# Altium schematic sheet Sheet1.SchDoc
size A; SheetNumber: 1; SheetTotal: 1
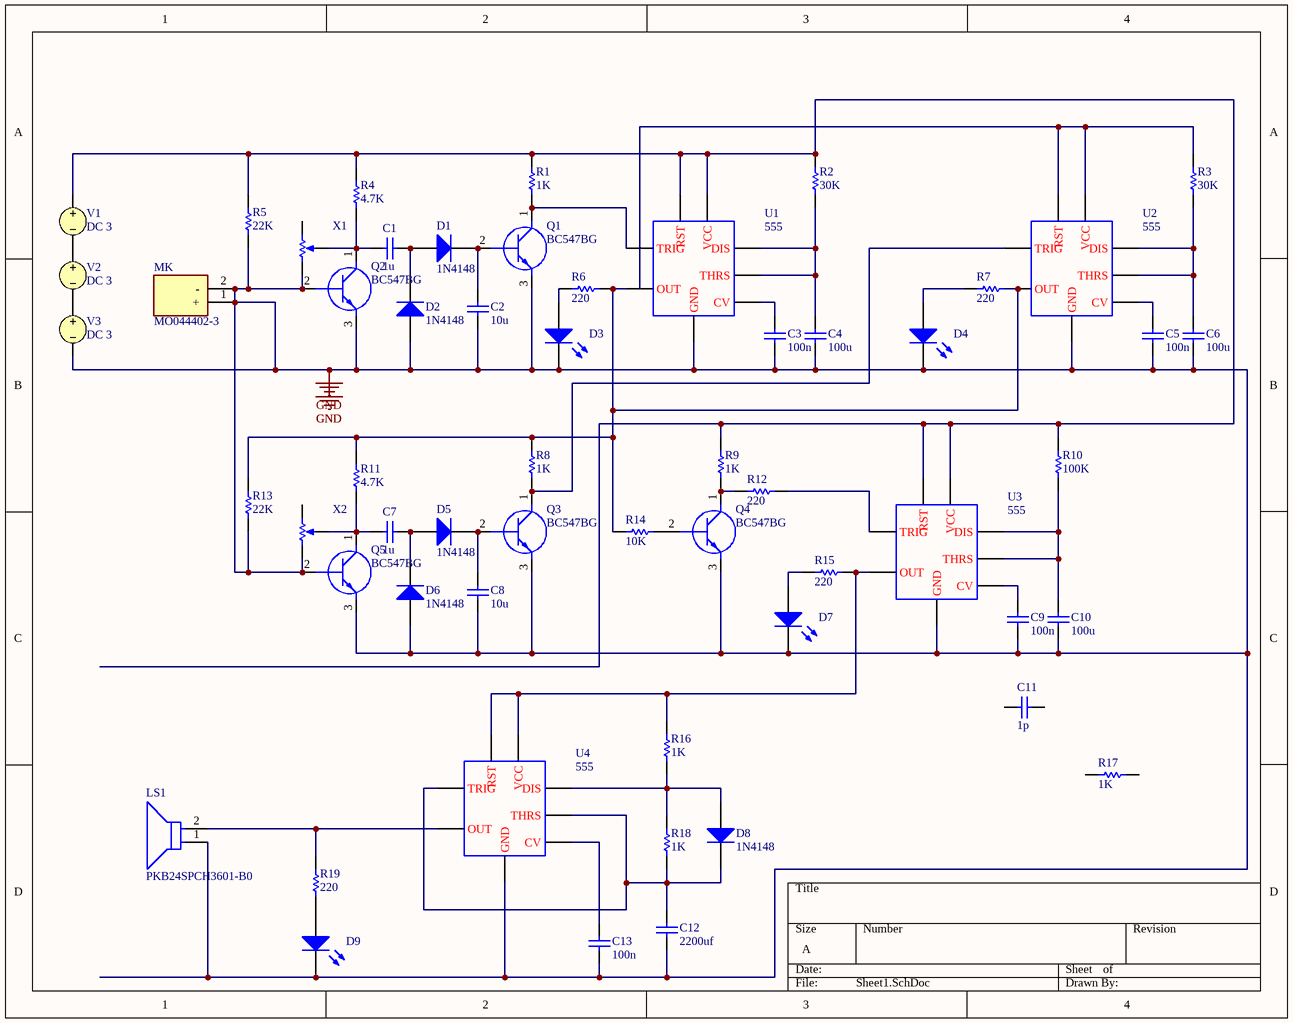
[diagram p0: Sheet1.SchDoc]

## Parts
C1  value 1u  (hidden comment: Capacitor)
C2  value 10u  (hidden comment: Capacitor)
C3  value 100n  (hidden comment: Capacitor)
C4  value 100u  (hidden comment: Capacitor)
C5  value 100n  (hidden comment: Capacitor)
C6  value 100u  (hidden comment: Capacitor)
C7  value 1u  (hidden comment: Capacitor)
C8  value 10u  (hidden comment: Capacitor)
C9  value 100n  (hidden comment: Capacitor)
C10  value 100u  (hidden comment: Capacitor)
C11  value 1p  (hidden comment: Capacitor)
C12  value 2200uf  (hidden comment: Capacitor)
C13  value 100n  (hidden comment: Capacitor)
D1  1N4148  [NXP-SOD27-2_V]
D2  1N4148  [NXP-SOD27-2_V]
D3  Light-Emitting Diode  (value not drawn)
D4  Light-Emitting Diode  (value not drawn)
D5  1N4148  [NXP-SOD27-2_V]
D6  1N4148  [NXP-SOD27-2_V]
D7  Light-Emitting Diode  (value not drawn)
D8  1N4148  [NXP-SOD27-2_V]
D9  Light-Emitting Diode  (value not drawn)
LS1  PKB24SPCH3601-B0  [FP-PKB24SPCH3601-B0-MFG]
MK  MO044402-3  [MO0444023]
Q1  BC547BG  [BC547BG]
Q2  BC547BG  [BC547BG]
Q3  BC547BG  [BC547BG]
Q4  BC547BG  [BC547BG]
Q5  BC547BG  [BC547BG]
R1  value 1K  (hidden comment: Resistor)
R2  value 30K  (hidden comment: Resistor)
R3  value 30K  (hidden comment: Resistor)
R4  value 4.7K  (hidden comment: Resistor)
R5  value 22K  (hidden comment: Resistor)
R6  value 220  (hidden comment: Resistor)
R7  value 220  (hidden comment: Resistor)
R8  value 1K  (hidden comment: Resistor)
R9  value 1K  (hidden comment: Resistor)
R10  value 100K  (hidden comment: Resistor)
R11  value 4.7K  (hidden comment: Resistor)
R12  value 220  (hidden comment: Resistor)
R13  value 22K  (hidden comment: Resistor)
R14  value 10K  (hidden comment: Resistor)
R15  value 220  (hidden comment: Resistor)
R16  value 1K  (hidden comment: Resistor)
R17  value 1K  (hidden comment: Resistor)
R18  value 1K  (hidden comment: Resistor)
R19  value 220  (hidden comment: Resistor)
U1  555
U2  555
U3  555
U4  555
V1  DC 3
V2  DC 3
V3  DC 3
X1  Potentiometer  (value not drawn)
X2  Potentiometer  (value not drawn)

## Nets
GND: C2.1 C3.1 C4.1 C5.1 C6.1 C8.1 C9.1 C10.1 C12.1 C13.1 D2.1(A) D3.2(K) D4.2(K) D6.1(A) D7.2(K) D9.2(K) LS1.1(C) MK.1(+) MK.2(-) Q1.3(E) Q2.2(B) Q2.3(E) Q3.3(E) Q4.3(E) Q5.2(B) Q5.3(E) R5.1 R13.1 U1.1(GND) U2.1(GND) U3.1(GND) U4.1(GND) V3.2 X1.1(TOP) X2.1(TOP)
NetC1_1: C1.1 Q2.1(C) R4.1 X1.3(TAP)
NetC1_2: C1.2 D1.1(A) D2.2(K)
NetC2_2: C2.2 D1.2(K) Q1.2(B)
NetC3_2: C3.2 U1.5(CV)
NetC4_2: C4.2 R2.1 U1.6(THRS) U1.7(DIS)
NetC5_2: C5.2 U2.5(CV)
NetC6_2: C6.2 R3.1 U2.6(THRS) U2.7(DIS)
NetC7_1: C7.1 Q5.1(C) R11.1 X2.3(TAP)
NetC7_2: C7.2 D5.1(A) D6.2(K)
NetC8_2: C8.2 D5.2(K) Q3.2(B)
NetC9_2: C9.2 U3.5(CV)
NetC10_2: C10.2 R10.1 U3.6(THRS) U3.7(DIS)
NetC12_2: C12.2 D8.2(K) R18.1 U4.2(TRIG) U4.6(THRS)
NetC13_2: C13.2 U4.5(CV)
NetD3_1: D3.1(A) R6.1
NetD4_1: D4.1(A) R7.1
NetD7_1: D7.1(A) R15.1
NetD8_1: D8.1(A) R16.1 R18.2 U4.7(DIS)
NetD9_1: D9.1(A) R19.1
NetLS1_2: LS1.2(A) R19.2 U4.3(OUT)
NetQ1_1: Q1.1(C) R1.1 U1.2(TRIG)
NetQ3_1: Q3.1(C) R8.1 U2.2(TRIG)
NetQ4_1: Q4.1(C) R9.1 R12.1
NetQ4_2: Q4.2(B) R14.2
NetR1_2: R1.2 R2.2 R4.2 R5.2 R9.2 R10.2 U1.4(RST) U1.8(VCC) U3.4(RST) U3.8(VCC) V1.1
NetR3_2: R3.2 U2.4(RST) U2.8(VCC)
NetR6_2: R6.2 R7.2 R8.2 R11.2 R13.2 R14.1 U1.3(OUT) U2.3(OUT)
NetR12_2: R12.2 U3.2(TRIG)
NetR15_2: R15.2 R16.2 U3.3(OUT) U4.4(RST) U4.8(VCC)
NetV1_2: V1.2 V2.1
NetV2_2: V2.2 V3.1

Not connected (* = marked no-connect by the designer): C11 1 2; R17 1 2; X1 2(BOT); X2 2(BOT)

## Library data of the parts
C1-C13 = Capacitor: SimulationGenericComponent: True
D1 D2 D5 D6 D8 = CMP-0648-00002-1: High-speed Diode, 100 V, 450 mA, 2-Pin SOD27, RoHS; Manufacturer: NXP Semiconductors; Configuration: Single; IR (VR: 20 V)=25 nA; IFRM: 450 mA; IFSM: 4 A Max.; Trr: 4 ns Max.; Cd: 4 pF Max.; VR: 100 V Max.; VF (IF: 10 mA)=1 V; IF: 200 mA Max.; ComponentLink1Description: Manufacturer URL; RoHS: TRUE; ComponentLink1URL: http://www.nxp.com/; ComponentLink3Description: Package Specification; DatasheetVersion: Aug-04; ComponentLink2Description: Datasheet; PackageVersion: Aug-04; PackageReference: SOD27; ComponentLink3URL: http://www.nxp.com/documents/data_sheet/1N4148_1N4448.pdf; Mounting Technology: Through Hole; ComponentLink2URL: http://www.nxp.com/documents/data_sheet/1N4148_1N4448.pdf; PartNumber: 1N4148; PackageDescription: 2-Pin Hermetically Sealed Glass Package, Axial Leaded, Dia 1.85 mm, Body Length 4.25 mm, Lead Spread 25.4 mm
D3 D4 D7 D9 = LED: AF: 1; BV: 0; BV_MAX: 1e99; EG: 1.11; FC: 0.5; IBV: 0.001; IS: 1e-14; MJSW: 0.33; NTUN: 30; TNOM: 27; XTI: 3; SimulationGenericComponent: True; CJO: 0; CJP: 0; CTA: 0; CTP: 0; FCS: 0.5; FV_MAX: 1e99; IKF: 0; IKR: 0; ISR: 1e-14; JSW: 0; JTUN: 0; JTUNSW: 0; KEG: 1; KF: 0; LEVEL: 1; N: 1; NBV: 1; NR: 1; NS: 1; PHP: 1; RS: 0; TCV: 0; TLEV: 0; TLEVC: 0; TM1: 0; TM2: 0; TPB: 0; TPHP: 0; TRS: 0; TRS2: 0; TT: 0; TTT1: 0; TTT2: 0; VJ: 1; XTITUN: 3
LS1 = CMP-06203-000001-2: AUDIO PIEZO TRANSDUCER 3-15V TH; Self Resonant Frequency: 3.6kHz; Voltage Rating (DC): 15V; Min Supply Voltage: 3V; Operating Supply Current: 16mA; Voltage Rating: 12V; Max Frequency: 4.1kHz; Washable: No; REACH SVHC: No SVHC; Packaging: Bulk; Frequency: 3.6kHz; Max Operating Temperature: 70°C; Max Supply Voltage: 15V; Max Supply Voltage (DC): 15V; Diameter: 24.3mm; Lead Free: Lead Free; Radiation Hardening: No; Nominal Supply Current: 16mA; Height: 9.7mm; Mount: Flush; Nominal Supply Voltage (DC): 12V; Min Operating Temperature: -20°C; Termination: PC Pins; Length: 24.3mm; Package Quantity: 650; Min Supply Voltage (DC): 3V; Max Supply Current: 16mA
MK = MO044402-3: Microphone; Manufacturer_Name: DB Unlimited; Datasheet Link: https://www.dbunlimitedco.com/images/product_images/2D-Drawings/MO044402-3.pdf; Height: 1.3mm; Manufacturer_Part_Number: MO044402-3; Mouser Part Number: 497-MO044402-3; Mouser Price/Stock: https://www.mouser.co.uk/ProductDetail/DB-Unlimited/MO044402-3?qs=t9M3m0YJX4P%252B6U8YhOQ9OQ%3D%3D; Arrow Part Number: MO044402-3; Arrow Price/Stock: https://www.arrow.com/en/products/mo044402-3/db-unlimited?region=nac
Q1-Q5 = BC547BG: Transistor BJT NPN; Manufacturer_Name: onsemi; Datasheet Link: https://www.onsemi.com/download/data-sheet/pdf/BC546-D.PDF; Height: 5.33mm; Manufacturer_Part_Number: BC547BG; Mouser Part Number: N/A; Mouser Price/Stock: http://www.mouser.com/Search/ProductDetail.aspx?qs=NSmgnqlvnz5NIKIycfR5CQ%3d%3d; Arrow Part Number: BC547BG; Arrow Price/Stock: http://www.arrow.com/en/products/bc547bg/on-semiconductor
R1-R19 = Resistor: TC1: 0; SimulationGenericComponent: True; TC2: 0
U1-U4 = 555: Timer 555; SimulationGenericComponent: True
V1-V3 = VSRC: Voltage Source; Note: PCB Footprint - Not required; AC Magnitude: 1; AC Phase: 0; Value: 3; Published: 8-Jun-2000; LatestRevisionDate: 17-Jul-2002; LatestRevisionNote: Re-released for DXP Platform.; PackageReference: Not Applicable; Publisher: Altium Limited
X1 X2 = Potentiometer: value: 100k; position: 0.5; SimulationGenericComponent: True